# Altium schematic sheet CPU.SchDoc: CPU
size A4; DrawnBy: Axel Vanherle, Nathan Bruggeman; DocumentNumber: 22-23P01S05; Revision: V1; SheetNumber: 5; SheetTotal: 5
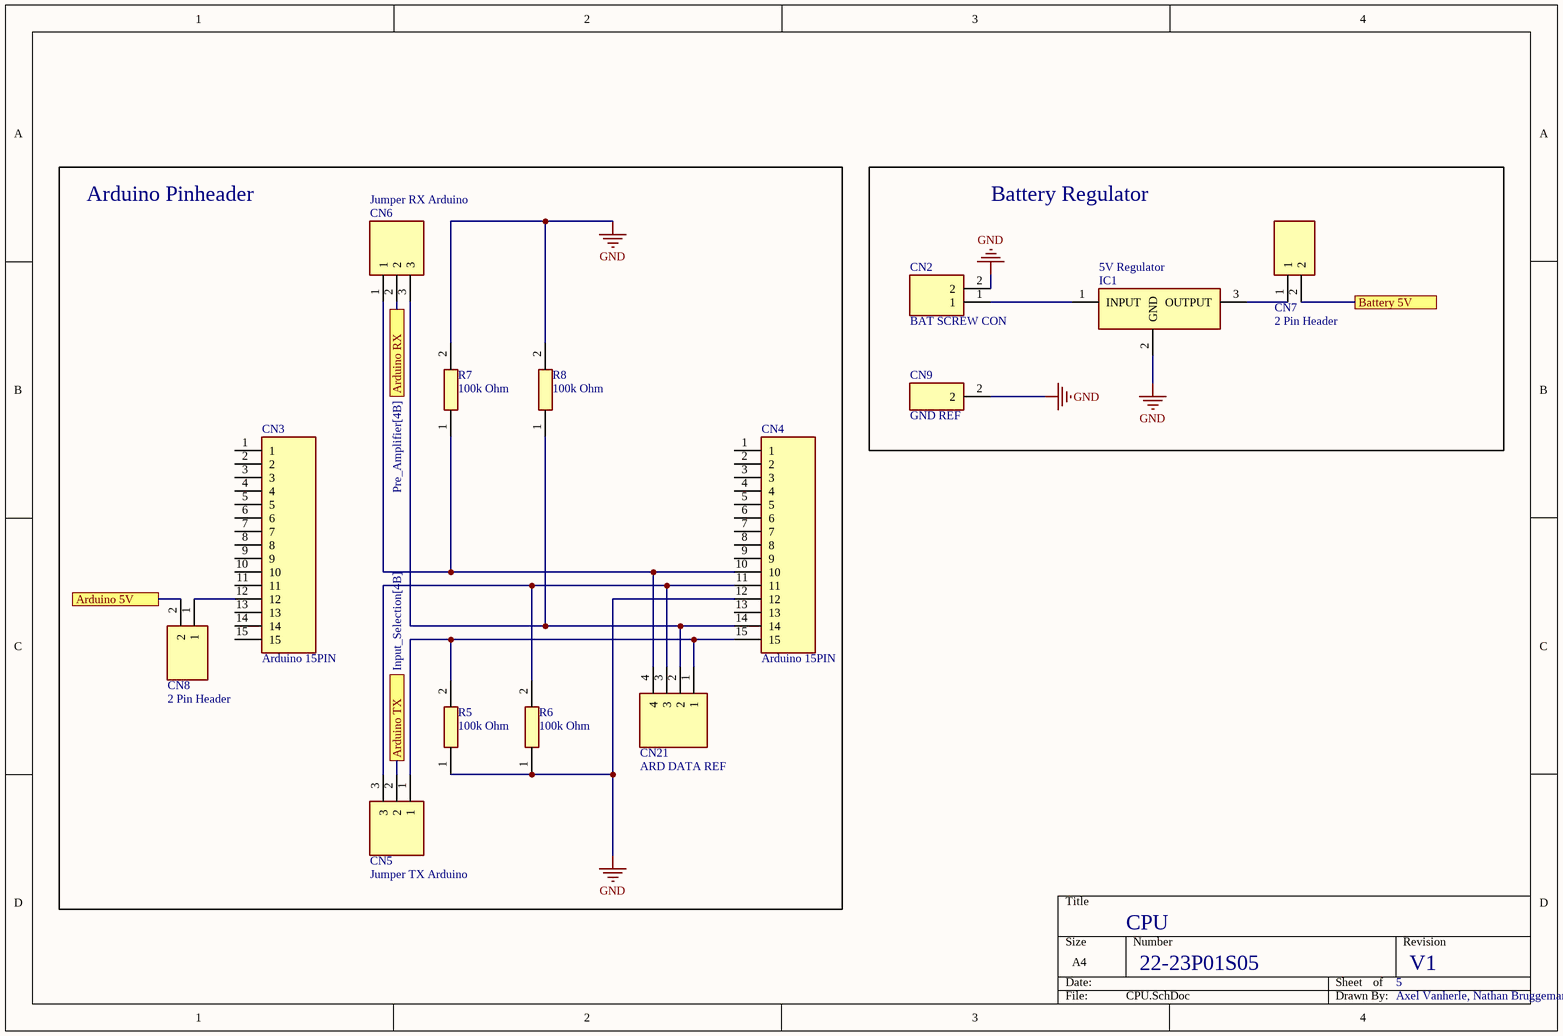
[diagram p0: CPU.SchDoc]

## Parts
CN2  BAT SCREW CON  [BAT SCREW CON]
CN3  Arduino 15PIN  [15 Pin Header]
CN4  Arduino 15PIN  [15 Pin Header]
CN5  Jumper TX Arduino  [3 Pin Header]
CN6  Jumper RX Arduino  [3 Pin Header]
CN7  2 Pin Header  [2 Pin Header]
CN8  2 Pin Header  [2 Pin Header]
CN9  GND REF  [1 PIN HEADER]
CN21  ARD DATA REF  [4 PIN HEADER]
IC1  5V Regulator  [5V Regulator]
R5  100k Ohm  [0805]
R6  100k Ohm  [0805]
R7  100k Ohm  [0805]
R8  100k Ohm  [0805]

## Blocks framed on the sheet
Arduino Pinheader: CN3-CN6 CN8 CN21 R5-R8
Battery Regulator: CN2 CN7 CN9 IC1

## Ports
Arduino 5V (see Input_Selection[1A]), Arduino RX (see Pre_Amplifier[4B]), Arduino TX (see Input_Selection[4B]), Battery 5V (see Input_Selection[1A])

## Nets
GND: CN2.2 CN4.12 CN9.2 IC1.2(GND) R5.1 R6.1 R7.2 R8.2
Arduino 5V: CN8.2 ; port Arduino 5V
Arduino RX: CN6.2 ; port Arduino RX
Arduino TX: CN5.2 ; port Arduino TX
Battery 5V: CN7.2 ; port Battery 5V
NetCN2_1: CN2.1 IC1.1(INPUT)
NetCN3_12: CN3.12 CN8.1
NetCN4_10: CN4.10 CN6.1 CN21.4 R7.1
NetCN4_11: CN4.11 CN5.3 CN21.3 R6.2
NetCN4_14: CN4.14 CN6.3 CN21.2 R8.1
NetCN4_15: CN4.15 CN5.1 CN21.1 R5.2
NetCN7_1: CN7.1 IC1.3(OUTPUT)

Not connected (* = marked no-connect by the designer): CN3 1 2 3 4 5 6 7 8 9 10 11 13 14 15; CN4 1 2 3 4 5 6 7 8 9 13

## Library data of the parts
CN2 = BAT SCREW CON: Connector; Manufacturer_Name: CUI Devices; Manufacturer_Part_Number: TB006-508-02BE; Datasheet Link: https://datasheet.datasheetarchive.com/originals/distributors/Datasheets_SAMA/b266c411a02422edb513b788238f8420.pdf; Height: 10.4mm; Mouser Part Number: 490-TB006-508-02BE; Mouser Price/Stock: https://www.mouser.co.uk/ProductDetail/CUI-Devices/TB006-508-02BE?qs=vLWxofP3U2wEdOVV%2FaT04w%3D%3D; Arrow Part Number: TB006-508-02BE; Arrow Price/Stock: https://www.arrow.com/en/products/tb006-508-02be/cui-devices?region=nac
CN3 CN4 = 15 Pin Header: 15 Pin Header Connector; Manufacturer_Name: SparkFun; Manufacturer_Part_Number: PRT-16279; Datasheet Link: https://cdn.sparkfun.com/assets/8/d/8/4/7/DS-16279-Arduino_Nano_Stackable_Header_Kit.pdf; Height: 8.65mm; Mouser Part Number: 474-PRT-16279; Mouser Price/Stock: https://www.mouser.co.uk/ProductDetail/SparkFun/PRT-16279?qs=vmHwEFxEFR8I6W1vfufYPg%3D%3D; Arrow Part Number: PRT-16279; Arrow Price/Stock: https://www.arrow.com/en/products/prt-16279/sparkfun-electronics?region=nac
CN5 CN6 = 3 Pin Header: TSW-103-07-G-S; Manufacturer_Name: SAMTEC; Datasheet Link: http://suddendocs.samtec.com/prints/tsw-xxx-xx-xxx-x-xx-xxx-mkt.pdf; Manufacturer_Part_Number: TSW-103-07-G-S; Mouser Part Number: 200-TSW10307GS; Mouser Price/Stock: https://www.mouser.co.uk/ProductDetail/Samtec/TSW-103-07-G-S?qs=iT52DjcXudtntd1jApTIAw%3D%3D; Arrow Part Number: TSW-103-07-G-S; Arrow Price/Stock: https://www.arrow.com/en/products/tsw-103-07-g-s/samtec?region=europe
CN7 CN8 = 2 Pin Header: Connector; Manufacturer_Name: TE Connectivity; Manufacturer_Part_Number: 5-146284-2; Datasheet Link: https://componentsearchengine.com/Datasheets/1/5-146284-2.pdf; Height: 8.21mm; Mouser Part Number: 571-5-146284-2; Mouser Price/Stock: https://www.mouser.co.uk/ProductDetail/TE-Connectivity/5-146284-2?qs=26tC0AmtfJgTF4M3cEQgiA%3D%3D; Arrow Part Number: 5-146284-2; Arrow Price/Stock: https://www.arrow.com/en/products/5-146284-2/te-connectivity
CN9 = 1 Pin Header: Connector; Manufacturer_Name: TE Connectivity; Manufacturer_Part_Number: 5-146281-1; Datasheet Link: https://www.mouser.com/datasheet/2/418/NG_CD_146281_G1-1238634.pdf; Height: 8.81mm; Mouser Part Number: 571-5-146281-1; Mouser Price/Stock: https://www.mouser.co.uk/ProductDetail/TE-Connectivity/5-146281-1?qs=bwpFY26eRVdQbbdvDiYEig%3D%3D; Arrow Part Number: 5-146281-1; Arrow Price/Stock: https://www.arrow.com/en/products/5-146281-1/te-connectivity
CN21 = 4 Pin Header: G800LW304032EU; Manufacturer_Name: Amphenol Communications Solutions; Datasheet Link: https://cdn.amphenol-cs.com/media/wysiwyg/files/drawing/g800lwxxxxxxeu.pdf; Height: 8.63mm; Manufacturer_Part_Number: G800LW304032EU; Mouser Part Number: 523-G800LW304032EU; Mouser Price/Stock: https://www.mouser.com/Search/Refine.aspx?Keyword=523-G800LW304032EU
IC1 = 5V Regulator: MC7805BDTG; Manufacturer_Name: onsemi; Datasheet Link: https://www.onsemi.com/pub/Collateral/MC7800-D.PDF; Height: 2.38mm; Manufacturer_Part_Number: MC7805BDTG; Mouser Part Number: 863-MC7805BDTG; Mouser Price/Stock: https://www.mouser.co.uk/ProductDetail/onsemi/MC7805BDTG?qs=%252B9%2Fcbd0IE0TYE8BQQ8My5g%3D%3D; Arrow Part Number: MC7805BDTG; Arrow Price/Stock: https://www.arrow.com/en/products/mc7805bdtg/on-semiconductor?region=europe
R5-R8 = Resistor: Manufacturer_Name: YAGEO; Manufacturer_Part_Number: RP0805BRD071KL; Datasheet Link: https://www.yageo.com/upload/media/product/products/datasheet/rchip/PYu-RP_51_RoHS_L_0.pdf; Height: 0.6mm; Mouser Part Number: 603-RP0805BRD071KL; Mouser Price/Stock: https://www.mouser.co.uk/ProductDetail/YAGEO/RP0805BRD071KL?qs=Y0Uzf4wQF3m8mAbG54g63Q%3D%3D